# Altium schematic sheet Micro.SchDoc
size A4
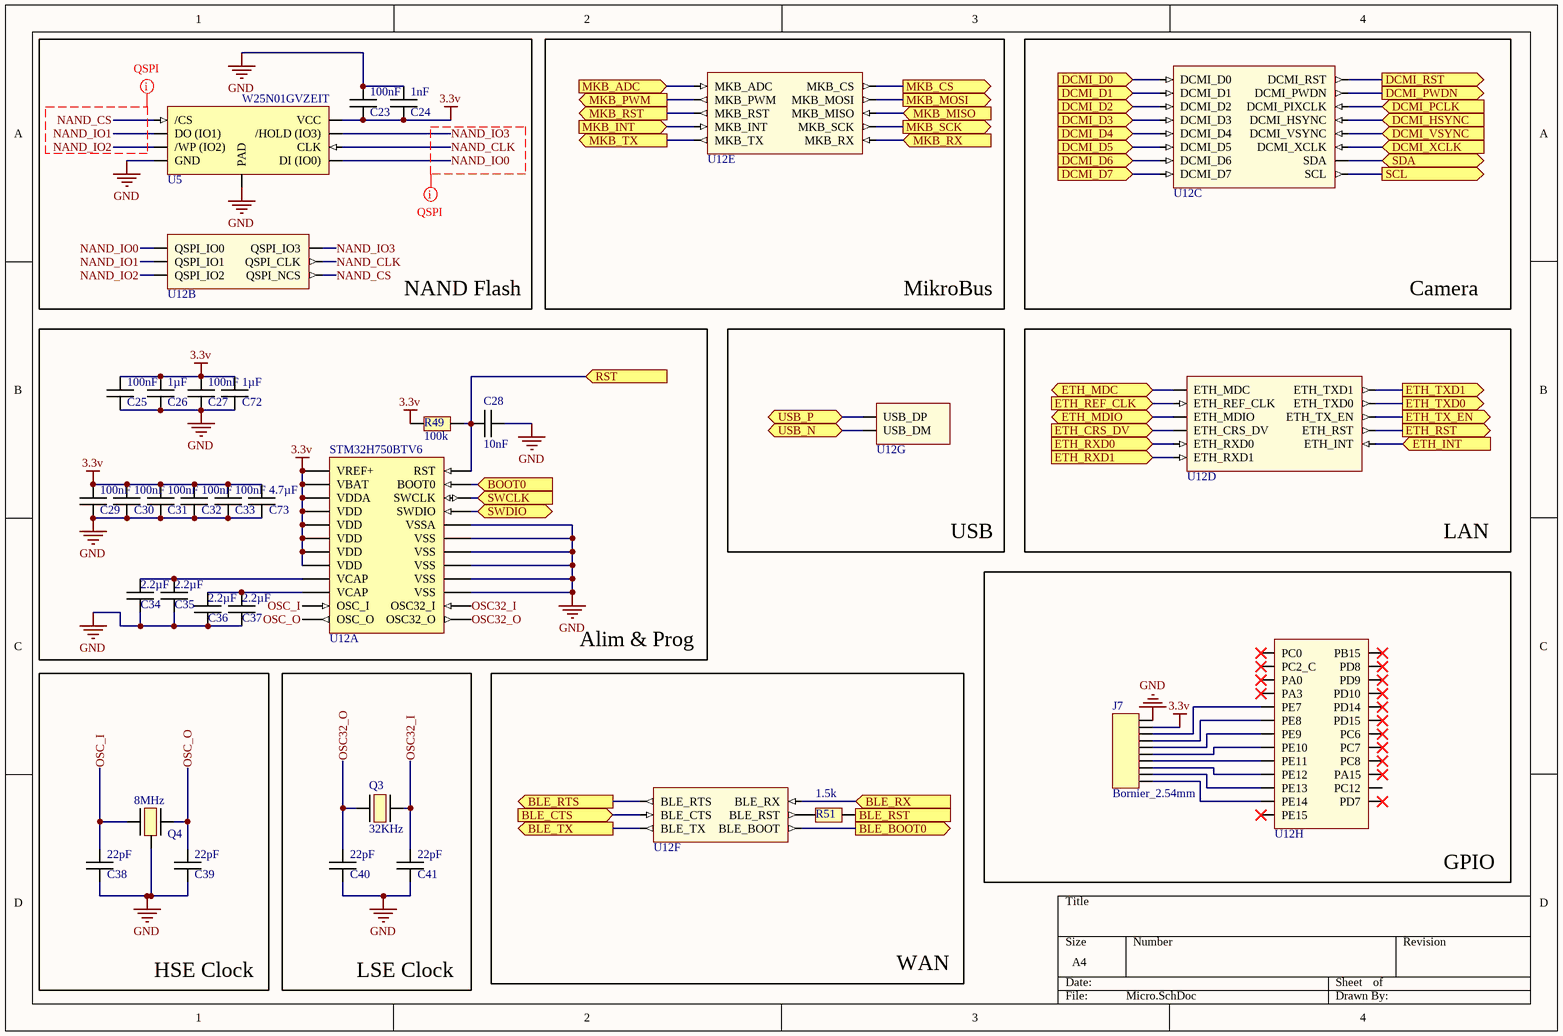
[diagram p0: Micro.SchDoc]

## Parts
C23  100nF  [0603]
C24  1nF  [0603]
C25  100nF  [0603]
C26  1µF  [0603]
C27  100nF  [0603]
C28  10nF  [0603]
C29  100nF  [0603]
C30  100nF  [0603]
C31  100nF  [0603]
C32  100nF  [0603]
C33  100nF  [0603]
C34  2.2µF  [0603]
C35  2.2µF  [0603]
C36  2.2µF  [0603]
C37  2.2µF  [0603]
C38  22pF  [0603]
C39  22pF  [0603]
C40  22pF  [0603]
C41  22pF  [0603]
C72  1µF  [0603]
C73  4.7µF  [0603]
J7  Bornier_2.54mm  [GPIO_header]
Q3  32KHz  [BLE_Quartz_Sxtal]
Q4  8MHz  [Quartz_Micro_HF]
R49  100k  [0603]
R51  1.5k  [0603]
U5  W25N01GVZEIT  [SON127P800X80_HS-9M]
U12  STM32H750BTV6  [LQFP100_14x14_0.5pitch]  (parts A,B,C,D,E,F,G,H of 8)

## Blocks framed on the sheet
NAND Flash: C23 C24 U5 U12
MikroBus: U12
Camera: U12
Alim & Prog: C25-C37 C72 C73 R49 U12
USB: U12
LAN: U12
GPIO: J7 U12
HSE Clock: C38 C39 Q4
LSE Clock: C40 C41 Q3
WAN: R51 U12

## Ports
BLE_BOOT0 (out), BLE_CTS (in), BLE_RST (out), BLE_RTS (out), BLE_RX (in), BLE_TX (out), BOOT0 (in), DCMI_D0 (in), DCMI_D1 (in), DCMI_D2 (in), DCMI_D3 (in), DCMI_D4 (in), DCMI_D5 (in), DCMI_D6 (in), DCMI_D7 (in), DCMI_HSYNC (in), DCMI_PCLK (in), DCMI_PWDN (out), DCMI_RST (out), DCMI_VSYNC (in), DCMI_XCLK (in), ETH_CRS_DV (in), ETH_INT (in), ETH_MDC (bidir), ETH_MDIO (bidir), ETH_REF_CLK (in), ETH_RST (out), ETH_RXD0 (in), ETH_RXD1 (in), ETH_TX_EN (out), ETH_TXD0 (out), ETH_TXD1 (out), MKB_ADC (in), MKB_CS (out), MKB_INT (in), MKB_MISO (in), MKB_MOSI (out), MKB_PWM (out), MKB_RST (out), MKB_RX (in), MKB_SCK (out), MKB_TX (out), RST (in), SCL (out), SDA (bidir), SWCLK (in), SWDIO (bidir), USB_N (bidir), USB_P (bidir)

## Nets
3.3v: C23.1 C24.1 C25.2 C26.2 C27.2 C29.2 C30.2 C31.2 C32.2 C33.2 C72.2 C73.2 J7.9 R49.2 U5.8(VCC) U12.6(VBAT) U12.11(VDD) U12.20(VREF+) U12.21(VDDA) U12.27(VDD) U12.50(VDD) U12.75(VDD) U12.100(VDD)
GND: C23.2 C24.2 C25.1 C26.1 C27.1 C28.1 C29.1 C30.1 C31.1 C32.1 C33.1 C34.1 C35.1 C36.1 C37.1 C38.1 C39.1 C40.1 C41.1 C72.1 C73.1 J7.10 Q4.3 U5.4(GND) U5.9(PAD) U12.10(VSS) U12.19(VSSA) U12.26(VSS) U12.49(VSS) U12.74(VSS) U12.99(VSS)
BLE_BOOT0: U12.81(BLE_BOOT) ; port BLE_BOOT0
BLE_CTS: U12.58(BLE_CTS) ; port BLE_CTS
BLE_RST: R51.1 ; port BLE_RST
BLE_RTS: U12.53(BLE_RTS) ; port BLE_RTS
BLE_RX: U12.79(BLE_RX) ; port BLE_RX
BLE_TX: U12.78(BLE_TX) ; port BLE_TX
BOOT0: U12.94(BOOT0) ; port BOOT0
DCMI_D0: U12.68(DCMI_D0) ; port DCMI_D0
DCMI_D1: U12.69(DCMI_D1) ; port DCMI_D1
DCMI_D2: U12.97(DCMI_D2) ; port DCMI_D2
DCMI_D3: U12.98(DCMI_D3) ; port DCMI_D3
DCMI_D4: U12.3(DCMI_D4) ; port DCMI_D4
DCMI_D5: U12.92(DCMI_D5) ; port DCMI_D5
DCMI_D6: U12.4(DCMI_D6) ; port DCMI_D6
DCMI_D7: U12.5(DCMI_D7) ; port DCMI_D7
DCMI_HSYNC: U12.28(DCMI_HSYNC) ; port DCMI_HSYNC
DCMI_PCLK: U12.30(DCMI_PIXCLK) ; port DCMI_PCLK
DCMI_PWDN: U12.7(DCMI_PWDN) ; port DCMI_PWDN
DCMI_RST: U12.2(DCMI_RST) ; port DCMI_RST
DCMI_VSYNC: U12.93(DCMI_VSYNC) ; port DCMI_VSYNC
DCMI_XCLK: U12.29(DCMI_XCLK) ; port DCMI_XCLK
ETH_CRS_DV: U12.31(ETH_CRS_DV) ; port ETH_CRS_DV
ETH_INT: U12.34(ETH_INT) ; port ETH_INT
ETH_MDC: U12.16(ETH_MDC) ; port ETH_MDC
ETH_MDIO: U12.24(ETH_MDIO) ; port ETH_MDIO
ETH_REF_CLK: U12.23(ETH_REF_CLK) ; port ETH_REF_CLK
ETH_RST: U12.35(ETH_RST) ; port ETH_RST
ETH_RXD0: U12.32(ETH_RXD0) ; port ETH_RXD0
ETH_RXD1: U12.33(ETH_RXD1) ; port ETH_RXD1
ETH_TX_EN: U12.47(ETH_TX_EN) ; port ETH_TX_EN
ETH_TXD0: U12.51(ETH_TXD0) ; port ETH_TXD0
ETH_TXD1: U12.52(ETH_TXD1) ; port ETH_TXD1
MKB_ADC: U12.18(MKB_ADC) ; port MKB_ADC
MKB_CS: U12.85(MKB_CS) ; port MKB_CS
MKB_INT: U12.84(MKB_INT) ; port MKB_INT
MKB_MISO: U12.90(MKB_MISO) ; port MKB_MISO
MKB_MOSI: U12.91(MKB_MOSI) ; port MKB_MOSI
MKB_PWM: U12.67(MKB_PWM) ; port MKB_PWM
MKB_RST: U12.83(MKB_RST) ; port MKB_RST
MKB_RX: U12.87(MKB_RX) ; port MKB_RX
MKB_SCK: U12.89(MKB_SCK) ; port MKB_SCK
MKB_TX: U12.86(MKB_TX) ; port MKB_TX
NAND_CLK: U5.6(CLK) U12.36(QSPI_CLK)
NAND_CS: U5.1(/CS) U12.46(QSPI_NCS)
NAND_IO0: U5.5(DI_(IO0)) U12.66(QSPI_IO0)
NAND_IO1: U5.2(DO_(IO1)) U12.59(QSPI_IO1)
NAND_IO2: U5.3(/WP_(IO2)) U12.1(QSPI_IO2)
NAND_IO3: U5.7(/HOLD_(IO3)) U12.60(QSPI_IO3)
OSC32_I: C41.2 Q3.1 U12.8(OSC32_I)
OSC32_O: C40.2 Q3.2 U12.9(OSC32_O)
OSC_I: C38.2 Q4.1 U12.12(OSC_I)
OSC_O: C39.2 Q4.2 U12.13(OSC_O)
RST: C28.2 R49.1 U12.14(RST) ; port RST
SCL: U12.95(SCL) ; port SCL
SDA: U12.96(SDA) ; port SDA
SWCLK: U12.76(SWCLK) ; port SWCLK
SWDIO: U12.72(SWDIO) ; port SWDIO
USB_N: U12.70(USB_DM) ; port USB_N
USB_P: U12.71(USB_DP) ; port USB_P
NetC34_2: C34.2 C35.2 U12.48(VCAP)
NetC36_2: C36.2 C37.2 U12.73(VCAP)
NetJ7_1: J7.1 U12.44(PE14)
NetJ7_2: J7.2 U12.43(PE13)
NetJ7_3: J7.3 U12.42(PE12)
NetJ7_4: J7.4 U12.41(PE11)
NetJ7_5: J7.5 U12.40(PE10)
NetJ7_6: J7.6 U12.39(PE9)
NetJ7_7: J7.7 U12.38(PE8)
NetJ7_8: J7.8 U12.37(PE7)
NetR51_2: R51.2 U12.82(BLE_RST)

Not connected (* = marked no-connect by the designer): U12 15(PC0)* 17(PC2_C)* 22(PA0)* 25(PA3)* 45(PE15)* 54(PB15)* 55(PD8)* 56(PD9)* 57(PD10)* 61(PD14)* 62(PD15)* 63(PC6)* 64(PC7)* 65(PC8)* 77(PA15)* 80(PC12) 88(PD7)*

## Layout directives
rule Matched Net Lengths [Tolerance = 2mm]; net class QSPI: NAND_CLK, NAND_CS, NAND_IO0, NAND_IO1, NAND_IO2, NAND_IO3

## Library data of the parts
C23-C41 C72 C73 = Capa
J7 = GPIO_bornier: Manufacturer 1: Multicomp; Manufacturer Part Number 1: 2212S-10SG-85; Description: MULTICOMP         2212S-10SG-85            Board-To-Board Connector, 2212S Series, Through Hole, Receptacle, 10 Contacts, 2.54 mm; Gender: Receptacle; Number of Contacts: 10; Insulation Resistance: 1GR; Supplier 1: Farnell; Stock 1: 33107; Pricing 1: 5=0,22700, 50=0,16700, 150=0,14500, 250=0,11700, 500=0,11300, 1500=0,10900, 2500=0,10500, 5000=0,10100 (EUR); RoHS: Yes; Mount: Through Hole; Weight: 0.11lb; Contact Plating: Gold; Contact Material: Copper Alloy; Number of Rows: 1; Termination: Through Hole; Length: 1.02inch; Height: 0.35inch; Width: 0.12inch; REACH SVHC: No SVHC; Flammability Rating: UL94 V-0; ComponentLink1URL: https://datasheet.ciiva.com/1434/1662126-1434006.pdf?src-supplier=Element14; ComponentLink1Description: https://datasheet.ciiva.com/1434/1662126-1434006.pdf?src-supplier=Element14; Supplier Part Number 1: 1593464
Q3 = BLE_quartz_Sxtal: Manufacturer 1: NDK; Manufacturer Part Number 1: NX2012SA-32.768K-STD-MUB-1; Frequency: 32.768kHz; Load Capacitance: 12.5pF; ESR (Equivalent Series Resistance): 80kR; Frequency Tolerance: 20ppm; Supplier 1: Digi-Key; Stock 1: 28609; Pricing 1: 1=0,91000, 10=0,80500, 50=0,75200, 100=0,66460, 500=0,62964, 1000=0,52470 (USD); RoHS: Yes; Mount: Surface Mount; Case/Package: SMD/SMT; Min Operating Temperature: -40°C; Max Operating Temperature: 85°C; Packaging: Tape and Reel; Length: 0.081inch; Height: 0.024inch; Width: 0.047inch; ComponentLink1URL: http://www.ndk.com/images/products/catalog/c_NX2012SA-STD-MUB-1_e.pdf?src-supplier=Digi-Key; ComponentLink1Description: http://www.ndk.com/images/products/catalog/c_NX2012SA-STD-MUB-1_e.pdf?src-supplier=Digi-Key; Supplier Part Number 1: 644-1219-1-ND
Q4 = Quartz_micro_HF: Manufacturer 1: Multicomp; Manufacturer Part Number 1: MCSJK-7I-8.00-10-10-60-B-10; Supplier 1: Farnell; Stock 1: 955; Pricing 1: 1=0,42000, 50=0,33900, 100=0,31500, 250=0,30400, 500=0,28100, 1000=0,25400, 5000=0,24900 (EUR); RoHS: No; ComponentLink1URL: http://www.farnell.com/datasheets/2608078.pdf?src-supplier=Farnell; ComponentLink1Description: http://www.farnell.com/datasheets/2608078.pdf?src-supplier=Farnell; Supplier Part Number 1: 2854010
R49 R51 = Resistance
U5 = W25N01GVZEIT: Manufacturer 1: Winbond; Supplier 1: Arrow; Manufacturer Part Number 1: W25N01GVZEIT; Stock 1: 984; Pricing 1: 1=2,30400, 10=2,07800, 25=2,03300, 50=2,00590, 100=1,79100, 250=1,72200, 500=1,69700, 1000=1,57900, 5000=1,41900 (USD); RoHS: No; Supplier Part Number 1: W25N01GVZEIT
U12 = STM32H750BTV6: Manufacturer 1: STMicroelectronics; Manufacturer Part Number 1: STM32H750VBT6; Interface: I2C,SPI,Ethernet,IrDA,MMC,SDIO,SD,UART,EBI/EMI; Peripherals: Brown-out Detect/Reset,POR,PWM,WDT,DMA,LCD; Memory Type: FLASH; Core Architecture: ARM; Frequency: 480MHz; Number of I/Os: 82; Memory Size: 128KB; Oscillator Type: Internal; Supplier 1: Farnell; Stock 1: 690; Pricing 1: 1=7,35000, 10=6,08000, 25=5,79000, 50=5,42000, 100=5,04000, 250=4,80000, 500=3,81000 (EUR); RoHS: No; Mount: Surface Mount; Case/Package: LQFP; Min Operating Temperature: -40°C; Max Operating Temperature: 85°C; Packaging: Tray; ComponentLink1URL: http://www.farnell.com/datasheets/2710930.pdf?src-supplier=Farnell; ComponentLink1Description: http://www.farnell.com/datasheets/2710930.pdf?src-supplier=Farnell; ComponentLink2URL: https://www.st.com/resource/en/errata_sheet/dm00399555.pdf?src-supplier=Digi-Key; ComponentLink2Description: https://www.st.com/resource/en/errata_sheet/dm00399555.pdf?src-supplier=Digi-Key; ComponentLink3URL: http://www.farnell.com/datasheets/2710930.pdf?src-supplier=Element14; ComponentLink3Description: http://www.farnell.com/datasheets/2710930.pdf?src-supplier=Element14; ComponentLink4URL: http://www.farnell.com/datasheets/2710930.pdf?src-supplier=Newark; ComponentLink4Description: http://www.farnell.com/datasheets/2710930.pdf?src-supplier=Newark; Supplier Part Number 1: 2980947